# EAGLE schematic EAGLE_Schaltplan (EAGLE 9.1.0)
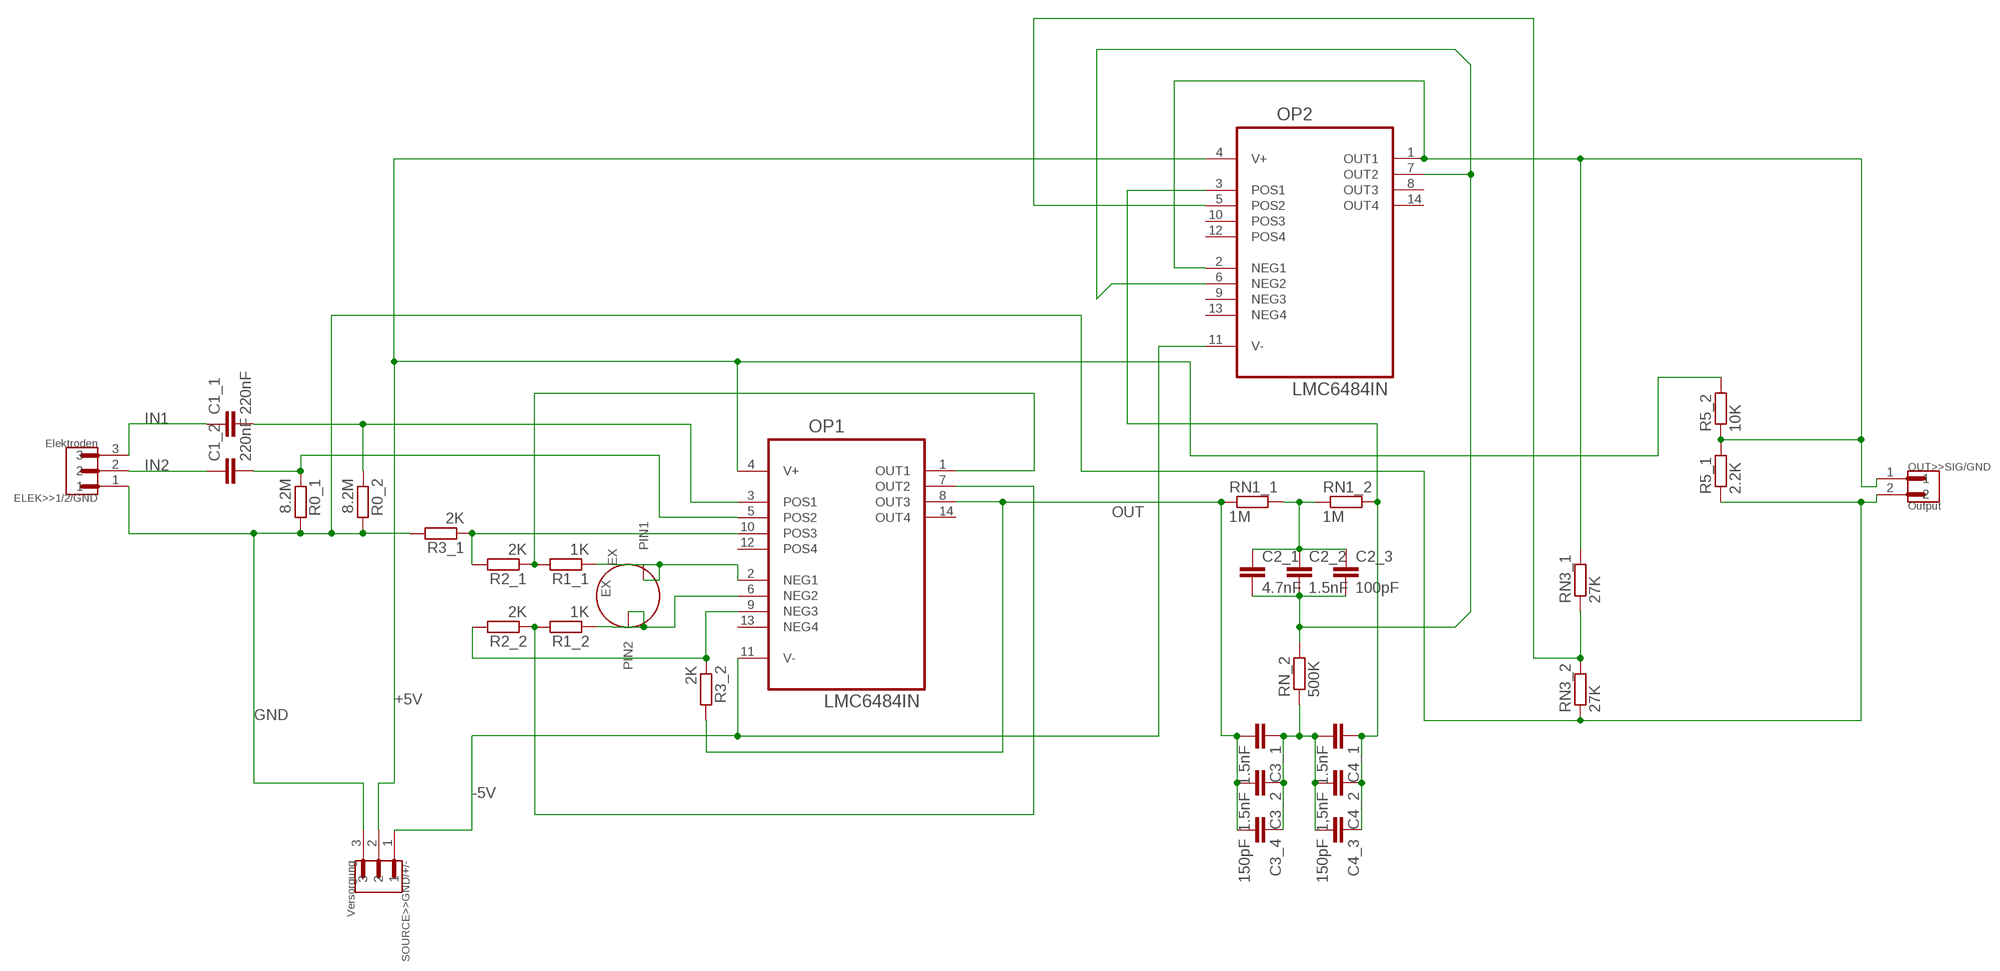
[diagram p0: schematic, sheet 1]

## Parts
C1_1  220nF  C-EU050-024X044  [C050-024X044]
C1_2  220nF  C-EU050-024X044  [C050-024X044]
C2_1  4.7nF  C-EU050-024X044  [C050-024X044]
C2_2  1.5nF  C-EU050-024X044  [C050-024X044]
C2_3  100pF  C-EU050-024X044  [C050-024X044]
C3_1  1.5nF  C-EU050-024X044  [C050-024X044]
C3_2  1.5nF  C-EU050-024X044  [C050-024X044]
C3_4  150pF  C-EU050-024X044  [C050-024X044]
C4_1  1.5nF  C-EU050-024X044  [C050-024X044]
C4_2  1,5nF  C-EU050-024X044  [C050-024X044]
C4_3  150pF  C-EU050-024X044  [C050-024X044]
ELEK>>1/2/GND  Elektroden  B3P-VH(LF)(SN)  [JST_B3P-VH(LF)(SN)]
OP1  LMC6484IN  [DIP254P762X508-14]
OP2  LMC6484IN  [DIP254P762X508-14]
OUT>>SIG/GND  Output  B2P-VH(LF)(SN)  [JST_B2P-VH(LF)(SN)]
POTI_1K  1K  FAN  [MOLEX_2PIN_SIDE]
R0_1  8.2M  R-EU_0207/7  [0207/7]
R0_2  8.2M  R-EU_0207/7  [0207/7]
R1_1  1K  R-EU_0207/7  [0207/7]
R1_2  1K  R-EU_0207/7  [0207/7]
R2_1  2K  R-EU_0207/7  [0207/7]
R2_2  2K  R-EU_0207/7  [0207/7]
R3_1  2K  R-EU_0207/7  [0207/7]
R3_2  2K  R-EU_0207/7  [0207/7]
R5_1  2.2K  R-EU_0207/7  [0207/7]
R5_2  10K  R-EU_0207/7  [0207/7]
RN1_1  1M  R-EU_0207/7  [0207/7]
RN1_2  1M  R-EU_0207/7  [0207/7]
RN3_1  27K  R-EU_0207/7  [0207/7]
RN3_2  27K  R-EU_0207/7  [0207/7]
RN_2  500K  R-EU_0207/7  [0207/7]
SOURCE>>GND/+/-  Versorgung  B3P-VH(LF)(SN)  [JST_B3P-VH(LF)(SN)]

## Nets
+5V: OP1.4(V+) OP2.4(V+) R5_2.2 SOURCE>>GND/+/-.2
-5V: OP1.11(V-) OP2.11(V-) SOURCE>>GND/+/-.1
GND: ELEK>>1/2/GND.1 OUT>>SIG/GND.2 R0_1.2 R0_2.2 R3_1.2 R5_1.1 RN3_2.1 SOURCE>>GND/+/-.3
IN1: C1_1.1 ELEK>>1/2/GND.3
IN2: C1_2.1 ELEK>>1/2/GND.2
N$1: OP1.2(NEG1) POTI_1K.P$1(PIN1) R1_1.1
N$2: OP1.6(NEG2) POTI_1K.P$2(PIN2) R1_2.1
N$3: OP1.7(OUT2) R1_2.2 R2_2.1
N$4: OP1.1(OUT1) R1_1.2 R2_1.1
N$5: OP1.10(POS3) R2_1.2 R3_1.1
N$6: OP1.9(NEG3) R2_2.2 R3_2.1
N$7: C2_1.1 C2_2.1 C2_3.1 RN1_1.2 RN1_2.1
N$8: OP2.1(OUT1) OP2.2(NEG1) OUT>>SIG/GND.1 R5_1.2 R5_2.1 RN3_1.2
N$9: C1_2.2 OP1.5(POS2) R0_1.1
N$10: C1_1.2 OP1.3(POS1) R0_2.1
N$12: C2_1.2 C2_2.2 C2_3.2 OP2.6(NEG2) OP2.7(OUT2) RN_2.2
N$14: OP2.5(POS2) RN3_1.1 RN3_2.2
N$15: C3_1.1 C3_2.1 C3_4.1 C4_1.2 C4_2.2 C4_3.2 RN_2.1
N$16: C4_1.1 C4_2.1 C4_3.1 OP2.3(POS1) RN1_2.2
OUT: C3_1.2 C3_2.2 C3_4.2 OP1.8(OUT3) R3_2.2 RN1_1.1
Unconnected: OP1.12(POS4) OP1.13(NEG4) OP1.14(OUT4) OP2.8(OUT3) OP2.9(NEG3) OP2.10(POS3) OP2.12(POS4) OP2.13(NEG4) OP2.14(OUT4) POTI_1K.EX

## Library data of the parts
C1_1 C1_2 C2_1-C2_3 C3_1 C3_2 C3_4 C4_1-C4_3 = resistor:C-EU: CAPACITOR, European symbol
ELEK>>1/2/GND SOURCE>>GND/+/- = B3P-VH_LF__SN_:B3P-VH(LF)(SN): VH Series 3 Position 3.96 mm Pitch Through Hole Crimp Locking Header; AVAILABILITY: Good; DESCRIPTION: VH Series 3 Position 3.96 mm Pitch Through Hole Crimp Locking Header; MF: JST; MP: B3P-VH_LF__SN_; PACKAGE: FakePackage u; PRICE: 0.12 USD
OP1 OP2 = LMC6484IN:LMC6484IN: OP Amps; AVAILABILITY: Good; DESCRIPTION: CMOS Quad Rail to Rail Input and Output Operational Amplifier 14-PDIP -40 to 85; MF: Texas Instruments; MP: LMC6484IN/NOPB; PACKAGE: DIP-14 Texas Instruments; PRICE: 2.27 USD
OUT>>SIG/GND = B2P-VH_LF__SN_:B2P-VH(LF)(SN): VH Series 3.96 mm Pitch, Compact, Lock Mechanism also Prevents Misinsertion; AVAILABILITY: Good; DESCRIPTION: VH Series 3.96 mm Pitch, Compact, Lock Mechanism also Prevents Misinsertion; MF: JST; MP: B2P-VH_LF__SN_; PACKAGE: FakePackage u; PRICE: 0.11 USD
POTI_1K = FAN:FAN; AVAILABILITY: Bad; DESCRIPTION: Middle Atlantic FAN 4.5 Inch Muffin Fan for Rack; MF: Middle Atlantic Products; MP: FAN; PACKAGE: None; PRICE: 49.89 USD
R0_1 R0_2 R1_1 R1_2 R2_1 R2_2 R3_1 R3_2 R5_1 R5_2 RN1_1 RN1_2 RN3_1 RN3_2 RN_2 = resistor:R-EU_: RESISTOR, European symbol